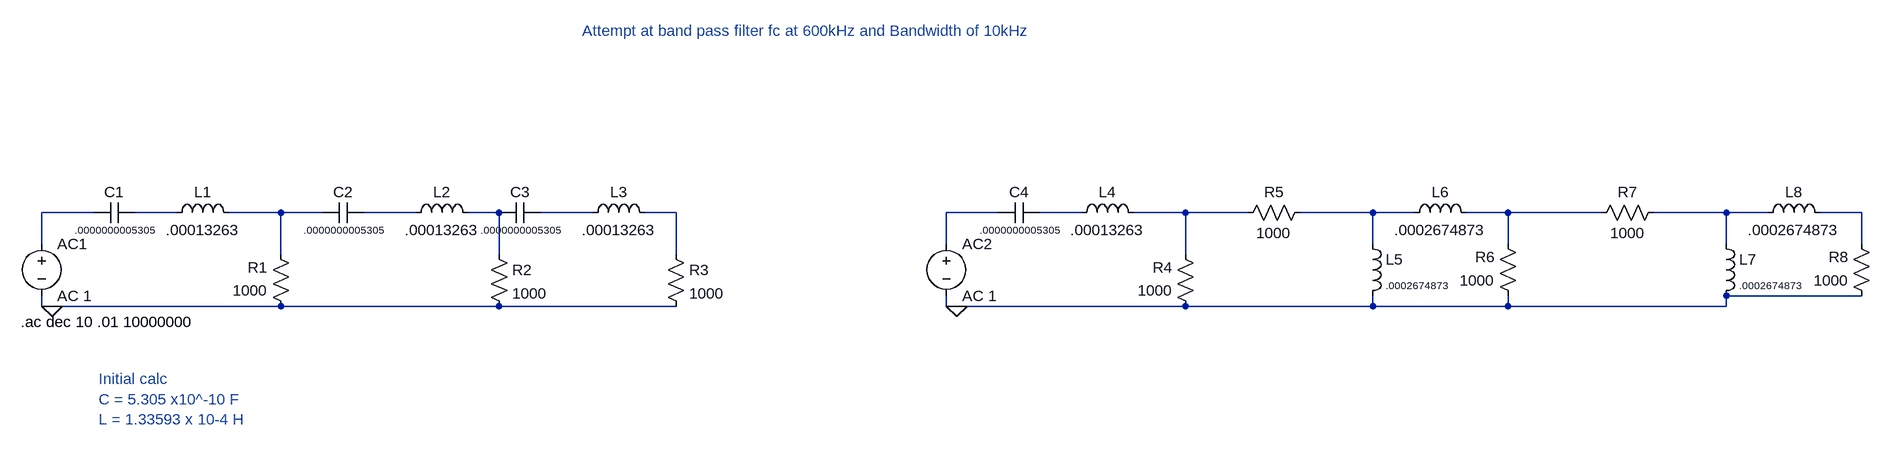
[diagram p0: schematic RLC Bandpass Higher order 1.asc]
RLC Bandpass Higher order 1.asc, the LTspice schematic file:
Version 4
SHEET 1 2164 680
WIRE -576 -64 -656 -64
WIRE -448 -64 -512 -64
WIRE -288 -64 -368 -64
WIRE -224 -64 -288 -64
WIRE -80 -64 -160 -64
WIRE 48 -64 0 -64
WIRE 192 -64 112 -64
WIRE 320 -64 272 -64
WIRE 816 -64 736 -64
WIRE 944 -64 880 -64
WIRE 1104 -64 1024 -64
WIRE 1200 -64 1104 -64
WIRE 1392 -64 1280 -64
WIRE 1456 -64 1392 -64
WIRE 1600 -64 1536 -64
WIRE 1744 -64 1600 -64
WIRE 1936 -64 1824 -64
WIRE 2000 -64 1936 -64
WIRE 2144 -64 2080 -64
WIRE -656 -16 -656 -64
WIRE 736 -16 736 -64
WIRE 1392 -16 1392 -64
WIRE 1600 -16 1600 -64
WIRE 1936 -16 1936 -64
WIRE 2144 -16 2144 -64
WIRE -288 0 -288 -64
WIRE 48 0 48 -64
WIRE 320 0 320 -64
WIRE 1104 0 1104 -64
WIRE 2144 64 1936 64
WIRE -656 80 -656 64
WIRE -640 80 -656 80
WIRE -288 80 -640 80
WIRE 48 80 -288 80
WIRE 320 80 48 80
WIRE 736 80 736 64
WIRE 752 80 736 80
WIRE 1104 80 752 80
WIRE 1392 80 1392 64
WIRE 1392 80 1104 80
WIRE 1600 80 1600 64
WIRE 1600 80 1392 80
WIRE 1936 80 1936 64
WIRE 1936 80 1600 80
FLAG -640 80 0
FLAG 752 80 0
SYMBOL res -272 96 R180
WINDOW 0 36 76 Left 2
WINDOW 3 36 40 Left 2
SYMATTR InstName R1
SYMATTR Value 1000
SYMBOL cap -512 -80 R90
WINDOW 0 0 32 VBottom 2
WINDOW 3 32 32 VTop 1
SYMATTR InstName C1
SYMATTR Value .0000000005305
SYMBOL ind -464 -48 R270
WINDOW 0 32 56 VTop 2
WINDOW 3 5 56 VBottom 2
SYMATTR InstName L1
SYMATTR Value .00013263
SYMBOL voltage -656 -32 R0
WINDOW 123 0 0 Left 0
WINDOW 39 0 0 Left 0
SYMATTR InstName AC1
SYMATTR Value AC 1
SYMBOL cap -160 -80 R90
WINDOW 0 0 32 VBottom 2
WINDOW 3 32 32 VTop 1
SYMATTR InstName C2
SYMATTR Value .0000000005305
SYMBOL ind -96 -48 R270
WINDOW 0 32 56 VTop 2
WINDOW 3 5 56 VBottom 2
SYMATTR InstName L2
SYMATTR Value .00013263
SYMBOL res 32 -16 R0
SYMATTR InstName R2
SYMATTR Value 1000
SYMBOL cap 112 -80 R90
WINDOW 0 0 32 VBottom 2
WINDOW 3 32 32 VTop 1
SYMATTR InstName C3
SYMATTR Value .0000000005305
SYMBOL ind 176 -48 R270
WINDOW 0 32 56 VTop 2
WINDOW 3 5 56 VBottom 2
SYMATTR InstName L3
SYMATTR Value .00013263
SYMBOL res 304 -16 R0
SYMATTR InstName R3
SYMATTR Value 1000
SYMBOL res 1120 96 R180
WINDOW 0 36 76 Left 2
WINDOW 3 36 40 Left 2
SYMATTR InstName R4
SYMATTR Value 1000
SYMBOL cap 880 -80 R90
WINDOW 0 0 32 VBottom 2
WINDOW 3 32 32 VTop 1
SYMATTR InstName C4
SYMATTR Value .0000000005305
SYMBOL ind 928 -48 R270
WINDOW 0 32 56 VTop 2
WINDOW 3 5 56 VBottom 2
SYMATTR InstName L4
SYMATTR Value .00013263
SYMBOL voltage 736 -32 R0
WINDOW 123 0 0 Left 0
WINDOW 39 0 0 Left 0
SYMATTR InstName AC2
SYMATTR Value AC 1
SYMBOL res 1296 -80 R90
WINDOW 0 0 56 VBottom 2
WINDOW 3 32 56 VTop 2
SYMATTR InstName R5
SYMATTR Value 1000
SYMBOL res 1616 80 R180
WINDOW 0 36 76 Left 2
WINDOW 3 36 40 Left 2
SYMATTR InstName R6
SYMATTR Value 1000
SYMBOL ind 1376 -32 R0
WINDOW 3 36 80 Left 1
SYMATTR InstName L5
SYMATTR Value .0002674873
SYMBOL ind 1440 -48 R270
WINDOW 0 32 56 VTop 2
WINDOW 3 5 56 VBottom 2
SYMATTR InstName L6
SYMATTR Value .0002674873
SYMBOL res 1840 -80 R90
WINDOW 0 0 56 VBottom 2
WINDOW 3 32 56 VTop 2
SYMATTR InstName R7
SYMATTR Value 1000
SYMBOL res 2160 80 R180
WINDOW 0 36 76 Left 2
WINDOW 3 36 40 Left 2
SYMATTR InstName R8
SYMATTR Value 1000
SYMBOL ind 1920 -32 R0
WINDOW 3 36 80 Left 1
SYMATTR InstName L7
SYMATTR Value .0002674873
SYMBOL ind 1984 -48 R270
WINDOW 0 32 56 VTop 2
WINDOW 3 5 56 VBottom 2
SYMATTR InstName L8
SYMATTR Value .0002674873
TEXT -688 104 Left 2 !.ac dec 10 .01 10000000
TEXT -568 192 Left 2 ;Initial calc\nC = 5.305 x10^-10 F\nL = 1.33593 x 10-4 H
TEXT 176 -344 Left 2 ;Attempt at band pass filter fc at 600kHz and Bandwidth of 10kHz

The netlist it stands for:
* RLC Bandpass Higher order 1.asc
R1 0 N003 1000
C1 N002 N001 .0000000005305
L1 N002 N003 .00013263
V§AC1 N001 0 AC 1
C2 N004 N003 .0000000005305
L2 N004 N005 .00013263
R2 N005 0 1000
C3 N006 N005 .0000000005305
L3 N006 N007 .00013263
R3 N007 0 1000
R4 0 N010 1000
C4 N009 N008 .0000000005305
L4 N009 N010 .00013263
V§AC2 N008 0 AC 1
R5 N011 N010 1000
R6 0 N012 1000
L5 N011 0 .0002674873
L6 N011 N012 .0002674873
R7 N013 N012 1000
R8 0 N014 1000
L7 N013 0 .0002674873
L8 N013 N014 .0002674873
.ac dec 10 .01 10000000
* Initial calc
* C = 5.305 x10^-10 F
* L = 1.33593 x 10-4 H
* Attempt at band pass filter fc at 600kHz and Bandwidth of 10kHz
.backanno
.end